# Altium schematic sheet REB215_XPRO_A_TopLevel.SchDoc: REB215_XPRO_A_Extension_Schematic
size A3; Organization: ATMEL R&D India; Address1: Kandanchavadi; Address2: Chennai; DocumentNumber: A09-2353; Revision: 2; SheetNumber: 1; SheetTotal: 3; PageSetup: Record=PageOptions|CenterHorizontal=True|CenterVertical=True|PrintScale=1.01|XCorrection=1.00|YCorrection=1.00|PrintKind=1|BorderSize=5000000|LeftOffset=0|BottomOffset=0|Orientation=2|PaperLength=1000|PaperWidth=1000|Scale=100|PaperSource=7|PrintQuality=-4|MediaType=1|DitherType=10|PaperKind=Letter|PrintScaleMode=1; DocumentName: REB215_XPRO_Extension_A
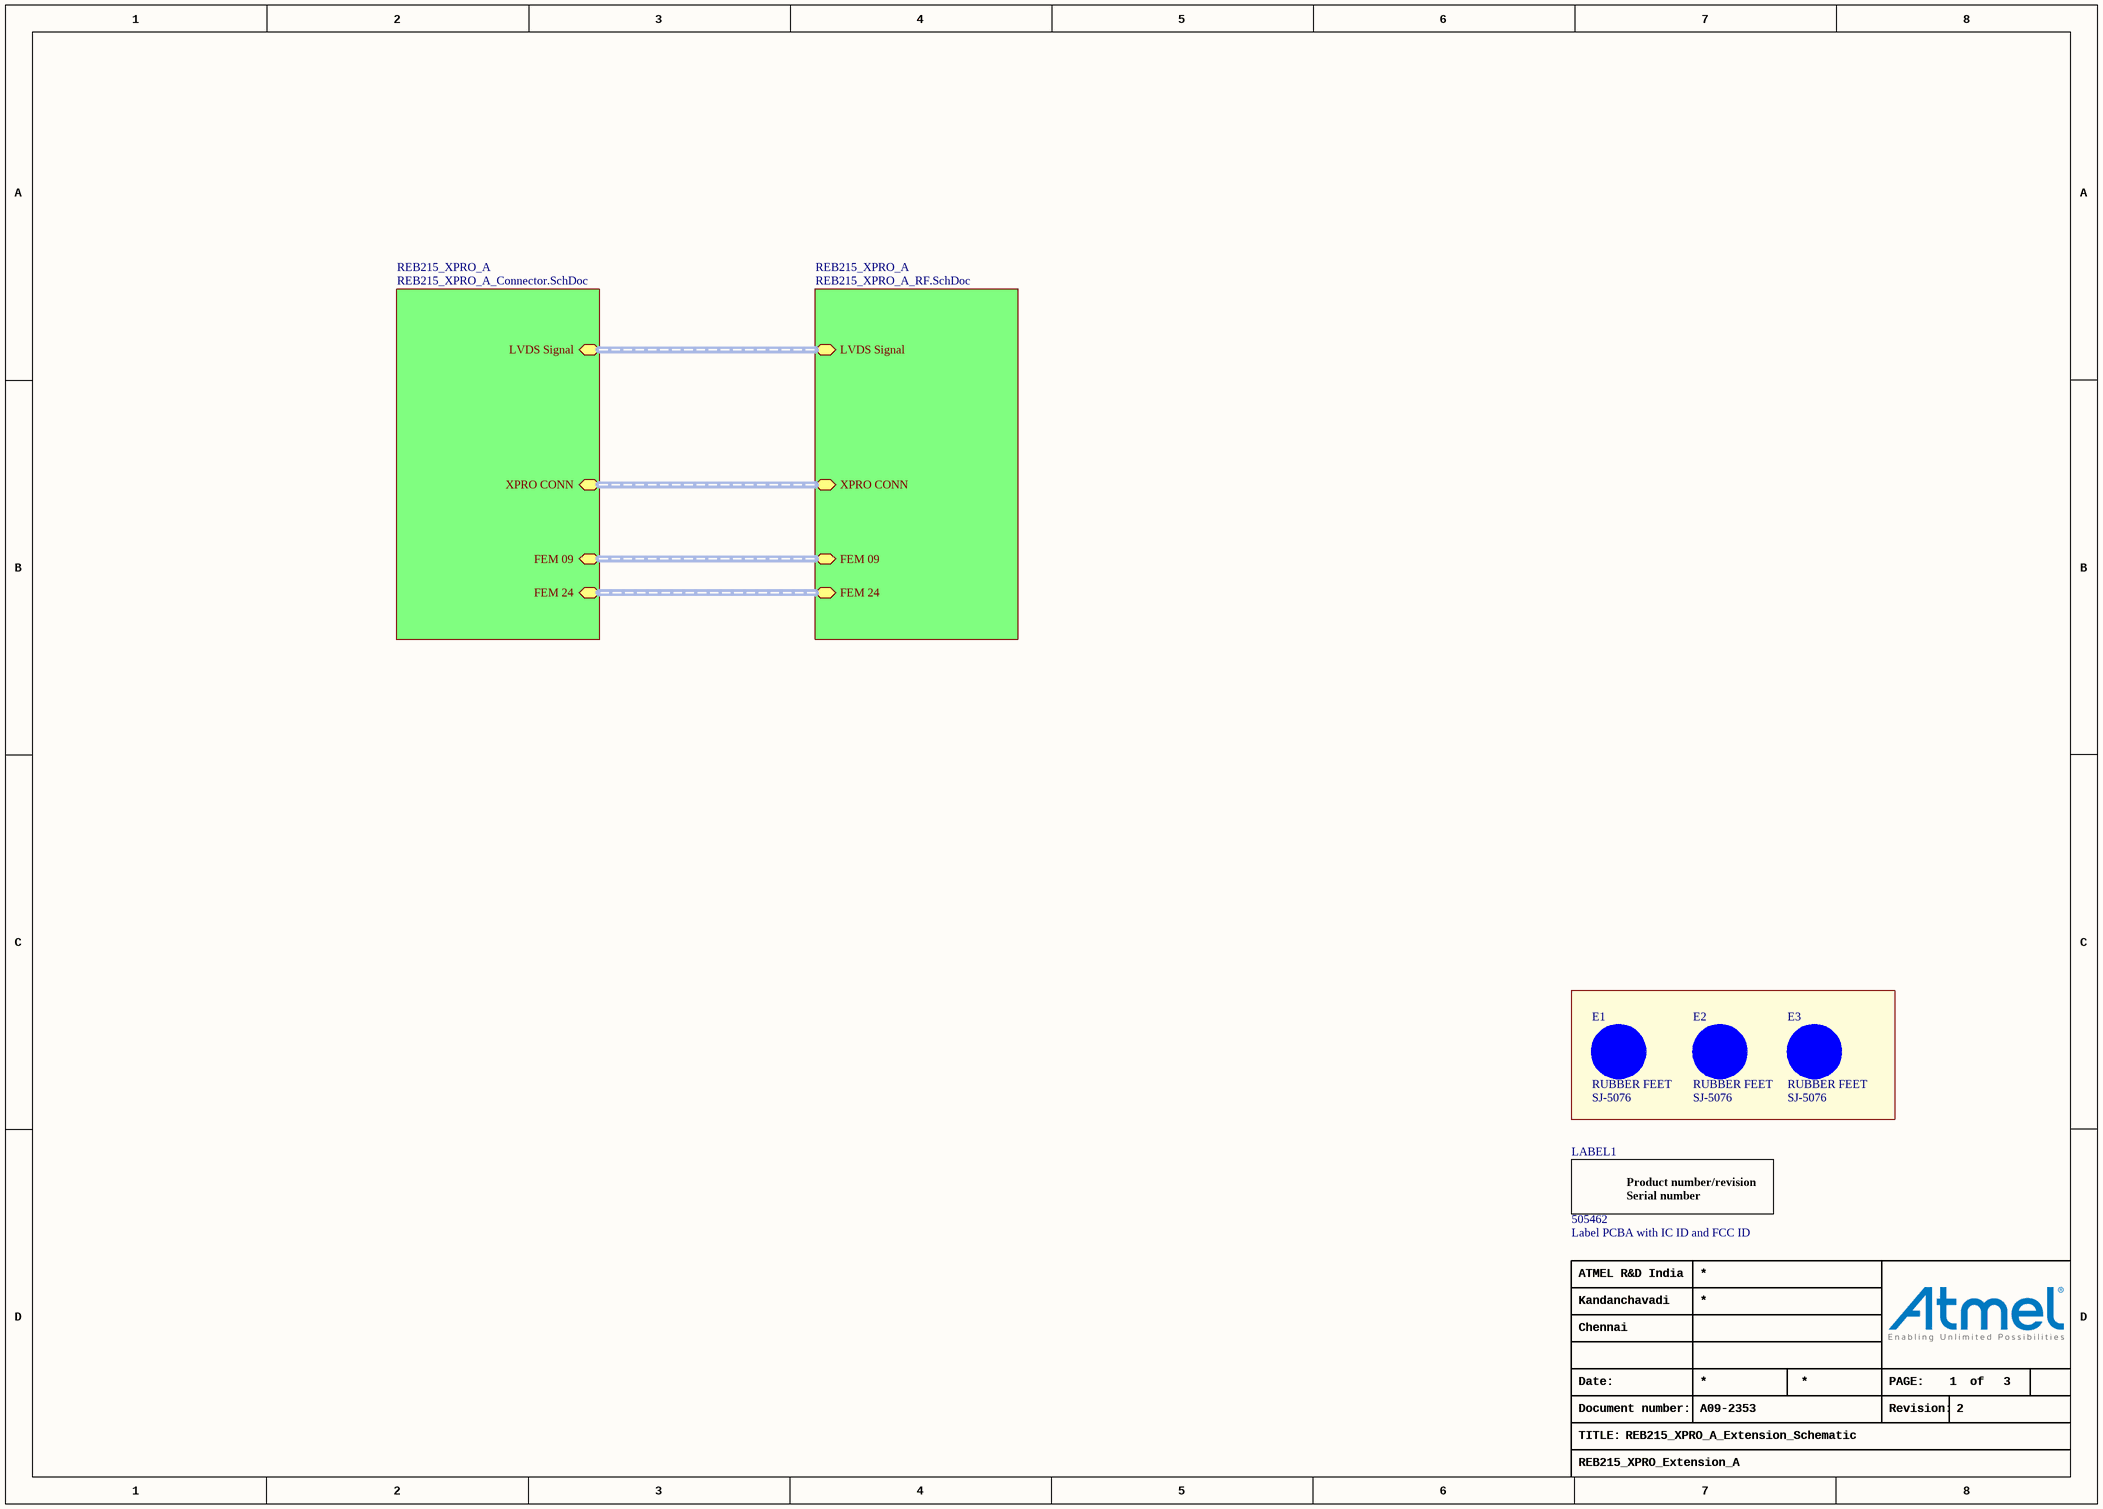
[diagram p0: REB215_XPRO_A_TopLevel.SchDoc]

## Parts
E1  RUBBER FEET  value SJ-5076  [AP8-00192]
E2  RUBBER FEET  value SJ-5076  [AP8-00192]
E3  RUBBER FEET  value SJ-5076  [AP8-00192]
LABEL1  Label PCBA with IC ID and FCC ID  value 505462  [AP8-00317]  (mechanical)

## Sub-sheets
REB215_XPRO_A = REB215_XPRO_A_Connector.SchDoc: LVDS Signal (harness LVDS Signal), XPRO CONN (harness XPRO CONN), FEM 09 (harness FEM 09), FEM 24 (harness FEM 24)
REB215_XPRO_A = REB215_XPRO_A_RF.SchDoc: LVDS Signal (harness LVDS Signal), XPRO CONN (harness XPRO CONN), FEM 09, FEM 24

## Nets

Not connected (* = marked no-connect by the designer): E1 1(FIDUCIAL); E2 1(FIDUCIAL); E3 1(FIDUCIAL)

## Notes on the sheet
- Date:
- PAGE:
- of
- TITLE:
- Document number:
- Revision:
- (in symbol A08-1825) / Product number/revision / Serial number

## Library data of the parts
E1-E3 = A08-0053: 2.8mm adhesive feet,diam 8.0mm; PartGroup: Mechanical devices,Mounting accessories; Manufacturer: 3M; ComponentStatus: 'Active (verified)'; Verified date: 2006-05-05; Verified by: Ketil Skjerve; Status: Active; AN: A08-0053; Height: 2.79999995231628; MPN: SJ-5076; FootprintStatus: 'Active (Verified)'
LABEL1 = A08-1825: Label for use on wireless PCBA that needs IC ID and FCC ID; PartGroup: Mechanical devices,Packaging materials,Printed Labels; Manufacturer: ACT Logimark AS; ComponentStatus: 'Active (verified)'; AN: A08-1825; MPN: 505462; FootprintStatus: 'Active (Verified)'